# EasyEDA schematic 6-coils-red-v1.json
TITLE: Sheet_1; REV: 1.0; Date: 2024-01-02; Sheet: 1/1; Company: Your Company
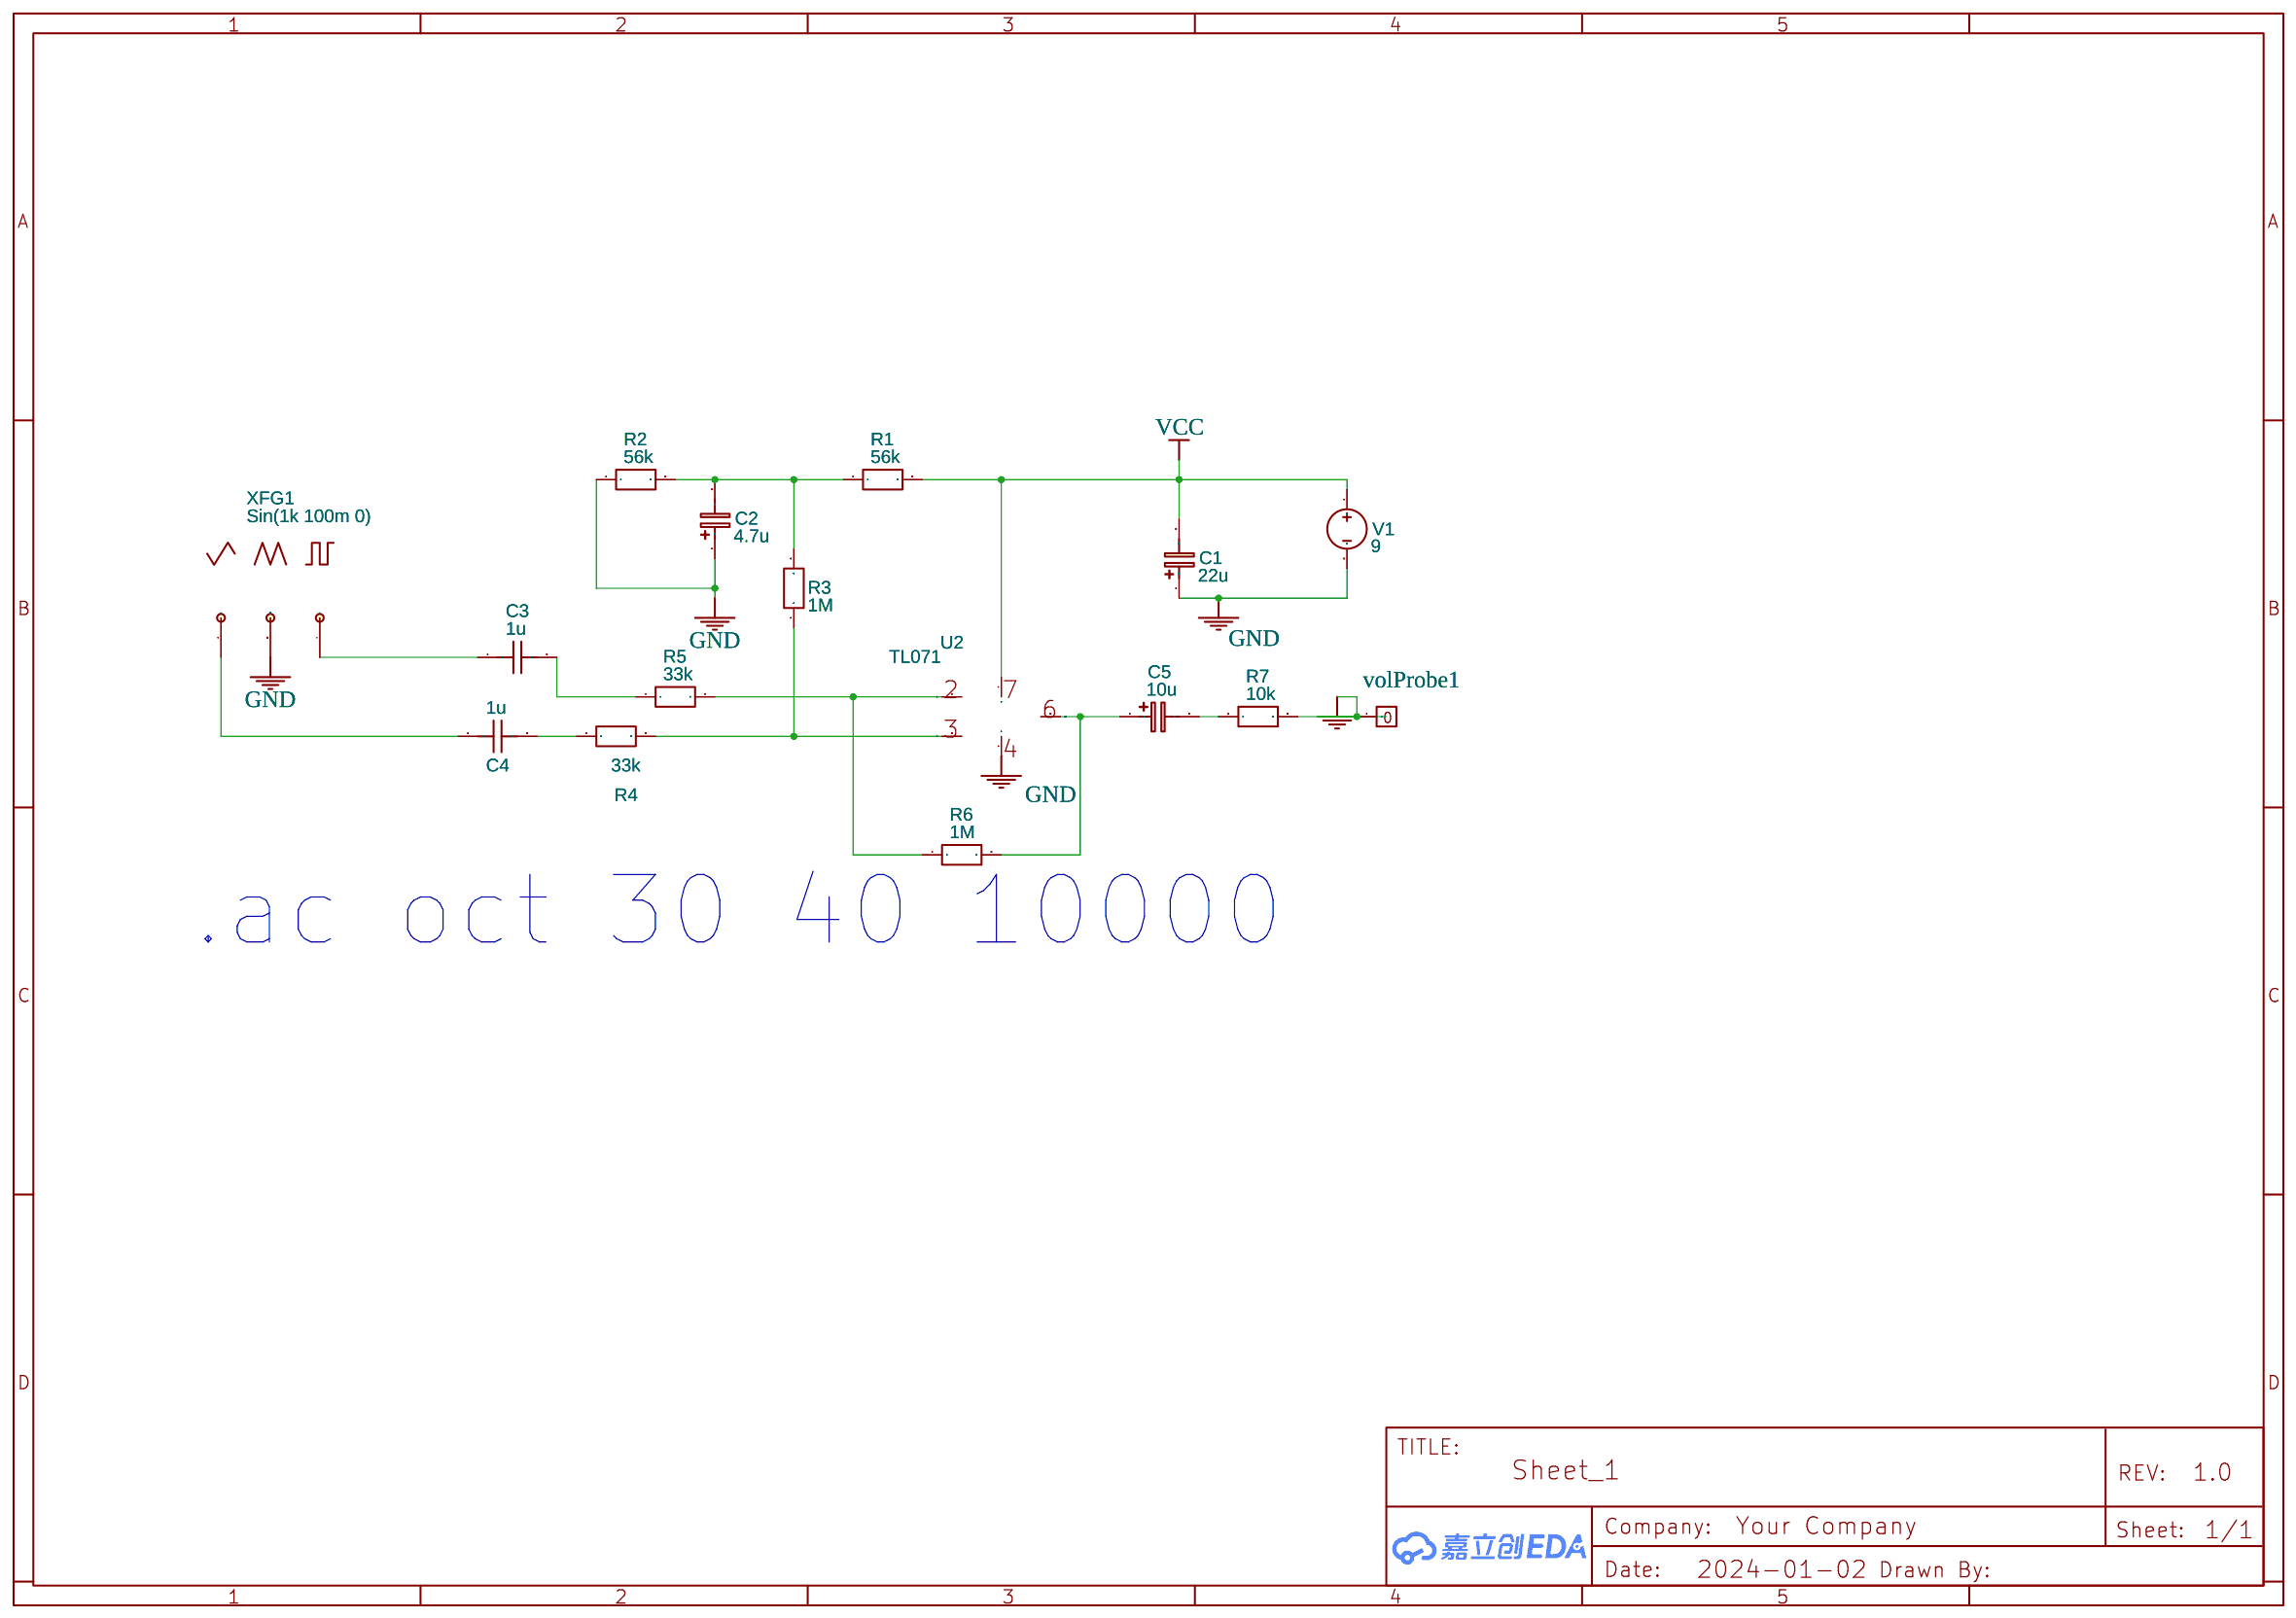
[diagram p0: schematic sheet]

## Parts
C1  22u  [SMD]
C2  4.7u  [SMD]
C3  1u  [C0603]
C4  1u  [C0603]
C5  10u  [SMD]
R1  56k  [R0603]
R2  56k  [R0603]
R3  1M  [R0603]
R4  33k  [R0603]
R5  33k  [R0603]
R6  1M  [R0603]
R7  10k  [R0603]
U1  Logic_Probe
U2  TL071  [LM741CN-DIP-8]
V1  9  [HDR1X2]
XFG1  Sin(1k 100m 0)

## Library data of the parts
C1 C2 C5 = C_Tan_SMD_A_EU: Contributor: LCEDA_Lib
C3 C4 = C_0603_US: Contributor: LCEDA_Lib
R1-R7 = R_0603_EU: Contributor: LCEDA_Lib
U1 = LOGICPROBE: Contributor: EasyEDA; PreDisplay: 0; NameDisplay: 0; Voltage: 0
U2 = LM741: Contributor: juan_g2; sim: true
V1 = VDC: Contributor: EasyEDA; sim: true
XFG1 = FUNCTIONGENERATOR: Supplier: LCSC; Waveforms: Sine Wave; Frequency: 1k; Duty cycle: 50; Amplitude: 100m; Offset: 0; Rise/Fall Time: 10; NameDisplay: 1; Contributor: EasyEDA; sim: true

## Nets
GND: C1.1 C2.1 R2.1 U2.4(V-) V1.2 XFG1.COM
VCC: C1.2 R1.2 U2.7(V+) V1.1
volProbe1: R7.2 U1.1
Net-(C2-2): C2.2 R1.1 R2.2 R3.2
Net-(C3-1): C3.1 XFG1.-
Net-(C3-2): C3.2 R5.1
Net-(C4-1): C4.1 XFG1.+
Net-(C4-2): C4.2 R4.1
Net-(C5-1): C5.1 R6.2 U2.6(OUT)
Net-(C5-2): C5.2 R7.1
Net-(R3-1): R3.1 R4.2 U2.3(IN+)
Net-(R5-2): R5.2 R6.1 U2.2(IN-)

## Notes on the sheet
- .ac oct 30 40 10000
